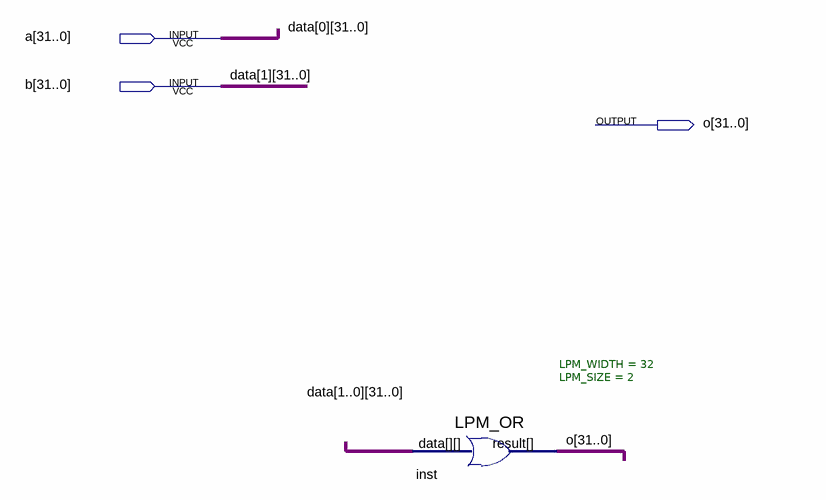
[diagram p0: schematic sheet]
// Quartus schematic OR32.bdf as structural Verilog: 1 symbols, 3 pins
module OR32 (
  input  [31:0] a,
  input  [31:0] b,
  output [31:0] o
);

  LPM_OR #(.LPM_WIDTH(32), .LPM_SIZE(2)) inst (.data({b, a}), .result(o));

  // Other names for the same wires on the sheet: data_0[31:0] = a; data_1[31:0] = b
endmodule
